# Altium schematic sheet antennaArray.SchDoc
size A4; SheetNumber: 1; SheetTotal: 1
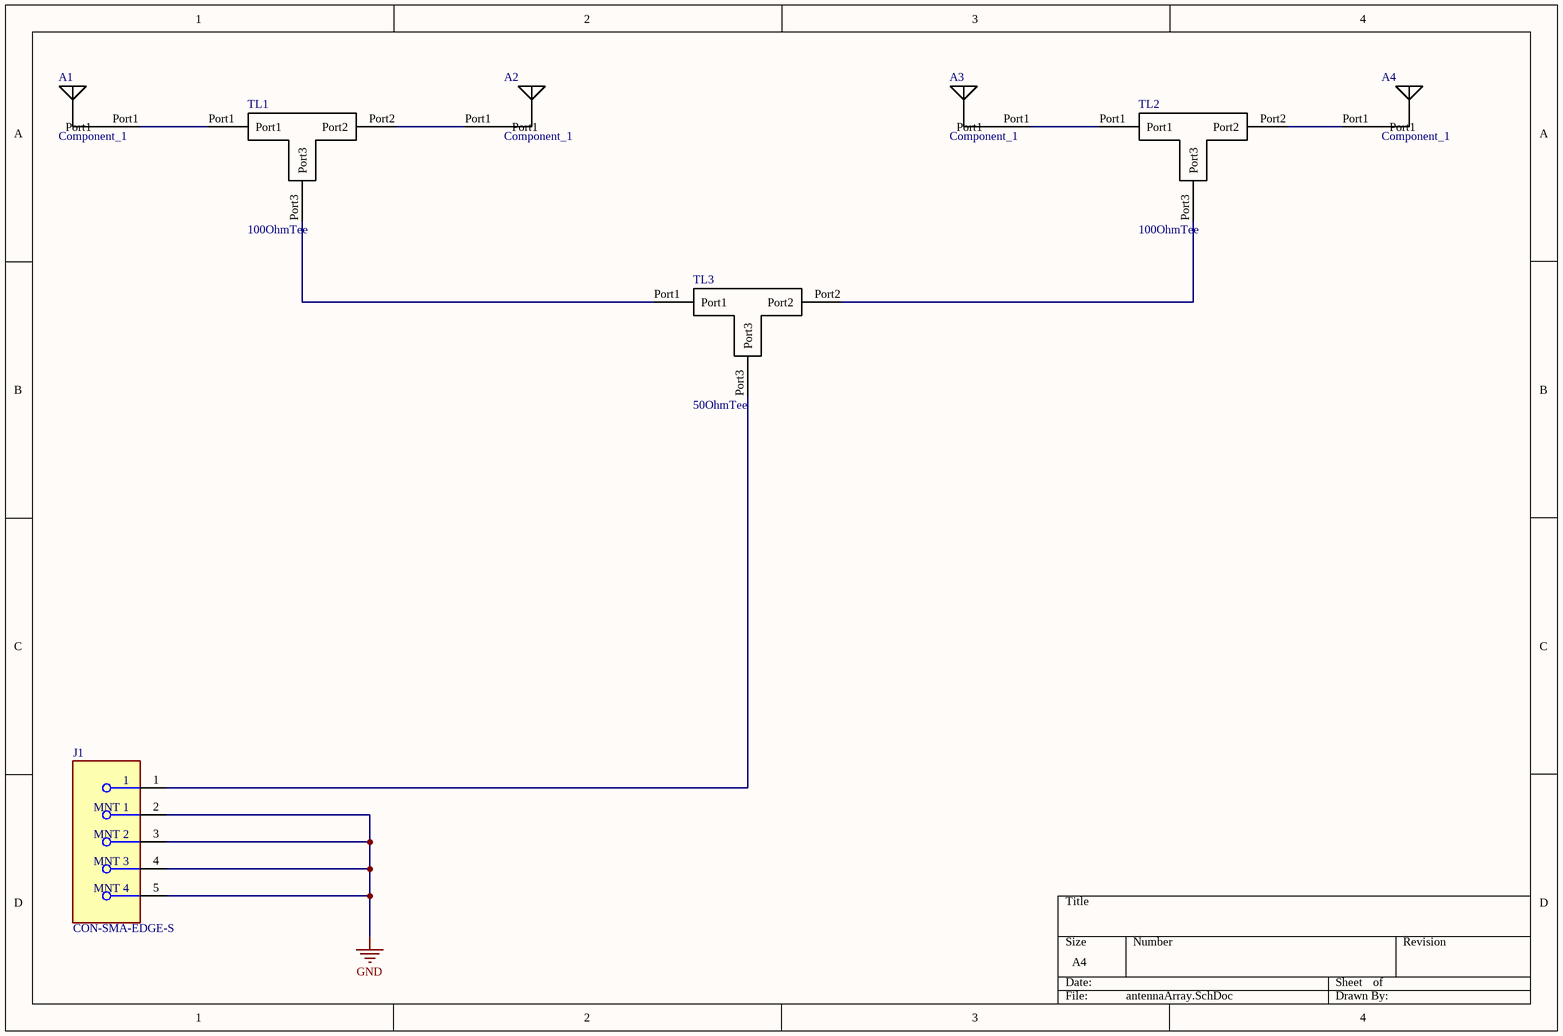
[diagram p0: antennaArray.SchDoc]

## Parts
A1  Component_1  [5GHzPatch]
A2  Component_1  [5GHzPatch]
A3  Component_1  [5GHzPatch]
A4  Component_1  [5GHzPatch]
J1  CON-SMA-EDGE-S  [FP-CON-SMA-EDGE-S-MFG]
TL1  100OhmTee  [100OhmTee]
TL2  100OhmTee  [100OhmTee]
TL3  50OhmTee  [50OhmTee]

## Nets
GND: J1.2(MNT_1) J1.3(MNT_2) J1.4(MNT_3) J1.5(MNT_4)
NetA1_Port1: A1.Port1 TL1.Port1
NetA2_Port1: A2.Port1 TL1.Port2
NetA3_Port1: A3.Port1 TL2.Port1
NetA4_Port1: A4.Port1 TL2.Port2
NetJ1_1: J1.1 TL3.Port3
NetTL1_Port3: TL1.Port3 TL3.Port1
NetTL2_Port3: TL2.Port3 TL3.Port2

## Library data of the parts
J1 = CMP-204357-000001-1: CONN SMA JACK STR EDGE MNT; Manufacturer: RF Solutions Ltd.; Impedance: 50Ω; Conn Orientation: Right Angle; Is Female: yes; Number Of Contacts: 1; Frequency: 18GHz; Shielding: true; Category: Conn; ComponentLink2URL: https://www.rfsolutions.co.uk/downloads/1498648656DS-CON-EDGE-SMA-4.pdf; Octopart: https://octopart.com/con-sma-edge-s-rf+solutions-70967450; Package: CONN_JACK; Manufacturer Part Number: CON-SMA-EDGE-S; Height: 6.35mm; Device Class L1: Connectors; Footprint Url: https://forum.upverter.com/uploads/default/original/3X/b/e/be75b907af57498775929d6d9099689c472e0307.pdf; Contact Material: Gold; ComponentLink2Description: Datasheet; Device Class L2: RF / Coaxial Connectors; RoHS: TRUE; Device Class L3: unset; Digikey Description: CONN SMA JACK STR EDGE MNT; Lead Free: Yes; Automotive: No